# Altium schematic sheet Power Sheet.SchDoc
size A; SheetNumber: 2; SheetTotal: 5
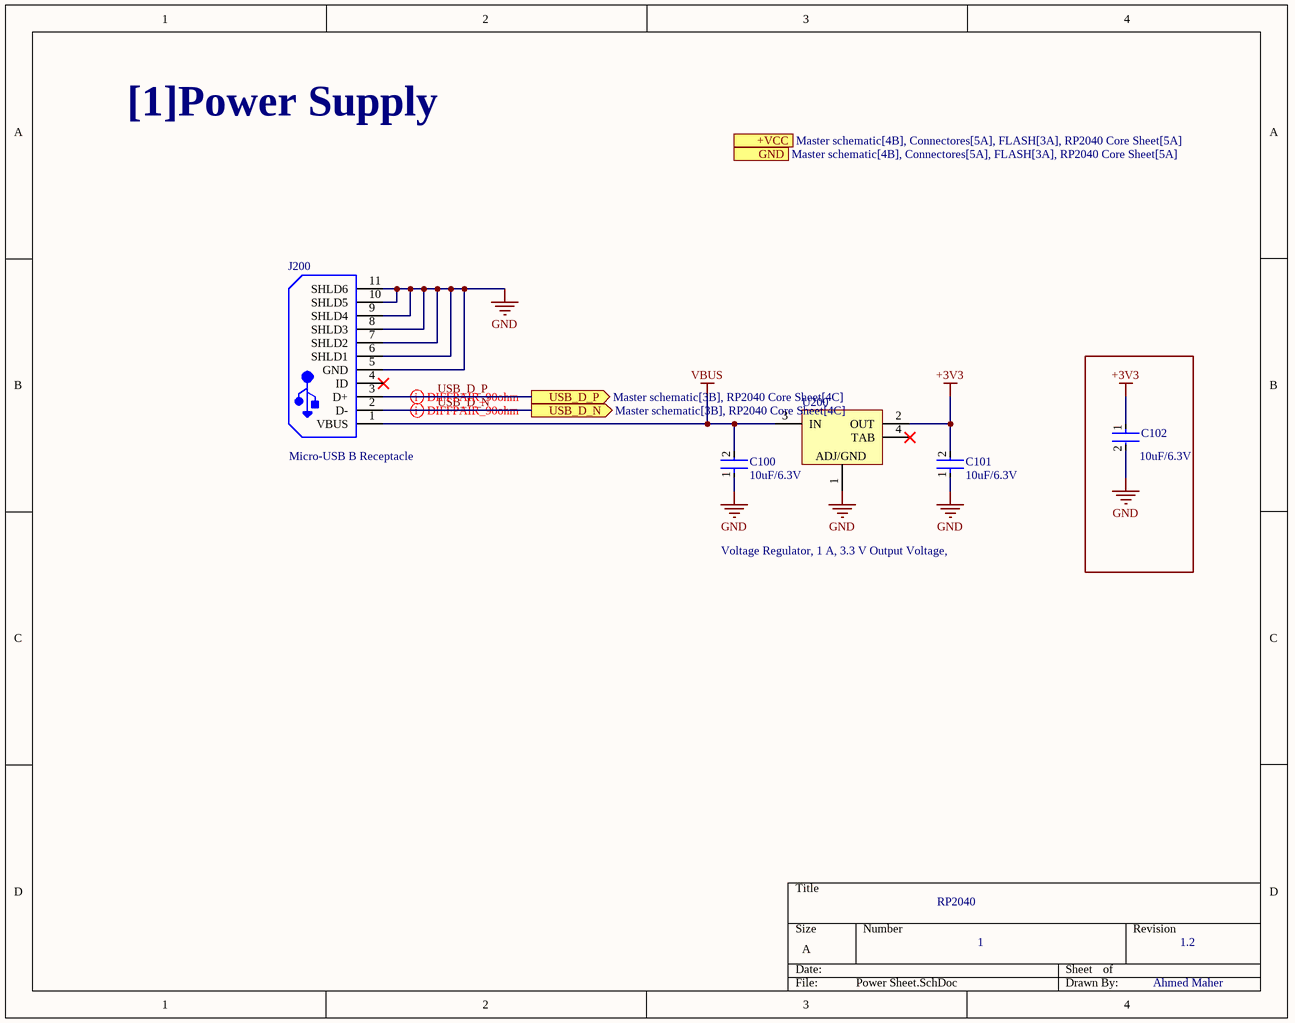
[diagram p0: Power Sheet.SchDoc]

## Parts
C100  10uF/6.3V  [FP-GRM188-0_1-e0_2_0_55-IPC_A]
C101  10uF/6.3V  [FP-GRM188-0_1-e0_2_0_55-IPC_A]
C102  GRM188R60J106ME47D  [FP-GRM188-0_1-e0_2_0_55-IPC_A]  (value not drawn)
J200  105017-0001  [USB-MICRO-B_V]  (value not drawn)
U200  NCP1117ST33T3G  [ONSC-SOT-223-4-318H-01_A_V]  (value not drawn)

## Blocks framed on the sheet
10uF/6.3V: C102

## Ports
+VCC (see Master schematic[4B], Connectores[5A], FLASH[3A], RP2040 Core Sheet[5A]), GND (see Master schematic[4B], Connectores[5A], FLASH[3A], RP2040 Core Sheet[5A]), USB_D_N (out, see Master schematic[3B], RP2040 Core Sheet[4C]), USB_D_P (out, see Master schematic[3B], RP2040 Core Sheet[4C])

## Nets
+3V3: C101.2 C102.1 U200.2(OUT)
GND: C100.1 C101.1 C102.2 J200.5(GND) J200.6(SHLD1) J200.7(SHLD2) J200.8(SHLD3) J200.9(SHLD4) J200.10(SHLD5) J200.11(SHLD6) U200.1(ADJ/GND)
VBUS: C100.2 J200.1(VBUS) U200.3(IN)
USB_D_N: J200.2(D-) ; port USB_D_N
USB_D_P: J200.3(D+) ; port USB_D_P

Not connected (* = marked no-connect by the designer): J200 4(ID)*; U200 4(TAB)*

## Layout directives
differential pair; differential pair class USB_90R: USB_D_N, USB_D_P

## Notes on the sheet
- [1]Power Supply
- (near J200) Micro-USB B Receptacle
- Voltage Regulator, 1 A, 3.3 V Output Voltage,
- RP2040
- 1
- 1.2
- Ahmed Maher

## Library data of the parts
C100-C102 = CMP-2006-02792-2: Chip Multilayer Ceramic Capacitors for General Purpose, 0603, 10uF, X5R, 15%, 20%, 6.3V; Packaging: Tape and Reel; Voltage Rating (DC): 6.3V; Width: 0.031inch; Termination: SMD/SMT; Dielectric: X5R; Package Quantity: 4000; Voltage Rating: 6.3V; Capacitance: 10uF; Case/Package: 0603; Min Operating Temperature: -55°C; Voltage: 6.3V; Length: 1.6mm; Thickness: 0.035inch; Lead Free: Lead Free; Depth: 0.8mm; Case Code (Imperial): 0603; Max Operating Temperature: 85°C; Material: Ceramic; Height: 0.8mm; Tolerance: 20%; Mount: Surface Mount; REACH SVHC: No SVHC; Radiation Hardening: No; Case Code (Metric): 1608
J200 = CMP-2000-05827-1: Micro-USB B Receptacle, Right Angle, Bottom Mount, Surface Mount, with Solder Tabs, -30 to 85 degC, 5-Pin USB, RoHS, Tape and Reel; Manufacturer: Molex; Featured Product: Micro-USBConnectorsUSBConnectors; Other Names: WM1399DKR; Package Version: Rev. F, 12/2012; Number of Contacts: 5; Connector Type: USB-microB; Catalog Drawings: 1050170001; 3D Model: 105017-0001.stp; Mating Products: WM17145-ND-CABLEMICROUSBBTOSTDA1.0MWM17147-ND-CABLEMICROUSBBTOSTDA2.0MWM17146-ND-CABLEMICROUSBBTOSTDA1.5M; PCN Assembly/Origin: ResinSupplier21/Oct/2015; Voltage - Max: 30V; Online Catalog: Molex-MicroUSB; Manufacturer URL: http://www.molex.com/; Package Description: 5-Leads USB, Micro B, Body 7.5 x 5 mm, Pitch 0.65 mm; Datasheet URL: http://www.molex.com/elqNow/elqRedir.htm?ref=http://www.molex.com/webdocs/datasheets/pdf/en-us/1050170001_IO_CONNECTORS.pdf; Ingress Protection: -; Datasheet Version: 03/2016; Mounting Type: BoardCutout,SurfaceMount,RightAngle; Circuits: 5; Standard Package: 1; Package Reference: MICRO-B; Package URL: http://www.molex.com/pdm_docs/sd/1050170001_sd.pdf; Category: Connectors,Interconnects; Series: -; RoHS Information: 1050170001CertofCompliance; Features: Shielded,SolderRetention; Family: USB,DVI,HDMIConnectors; Specifications: -; Gender: Receptacle; Packaging: Digi-Reel®; Mounting Technology: SurfaceMount
U200 = CMP-1679-00010-1: Low-Dropout Positive Fixed Voltage Regulator, 1 A, 3.3 V Output Voltage, 0 to 125 degC, 4-Pin SOT-223 (318H-01), Pb-Free, Tape and Reel; Resistance: 220 kohm; Type (Resistor): Thick Film; Voltage Rating: 75 V; Tolerance: 1%; Case\Package: 0603; Power Rating: 100 mW; Width: 0.85 mm; Weight: 7.1E-05 oz; ComponentLink2URL: http://www.onsemi.com/pub_link/Collateral/NCP1117-D.PDF; RoHSCompliant: true; Height: 0.45 mm; PackageDescription: 4-Pin Small Outline Transistor, Body 6.5 x 3.5 mm, Pitch 2.3 mm; ComponentLink1Description: Manufacturer URL; ComponentLink1URL: http://www.onsemi.com/; PackageReference: SOT-223-4-318H-01_A; Max Operating Temperature: 155 degC; Packaging: Tape and Reel; REACH SVHC: Unknown; Length: 1.55 mm; Package Quantity: 5000; Radiation Hardening: No; Min Operating Temperature: -55 degC; DatasheetVersion: Rev. 27, 09/2014; Mount: Surface Mount; Case Code (Imperial): 0603; Case Code (Metric): 1608; ComponentLink2Description: Datasheet